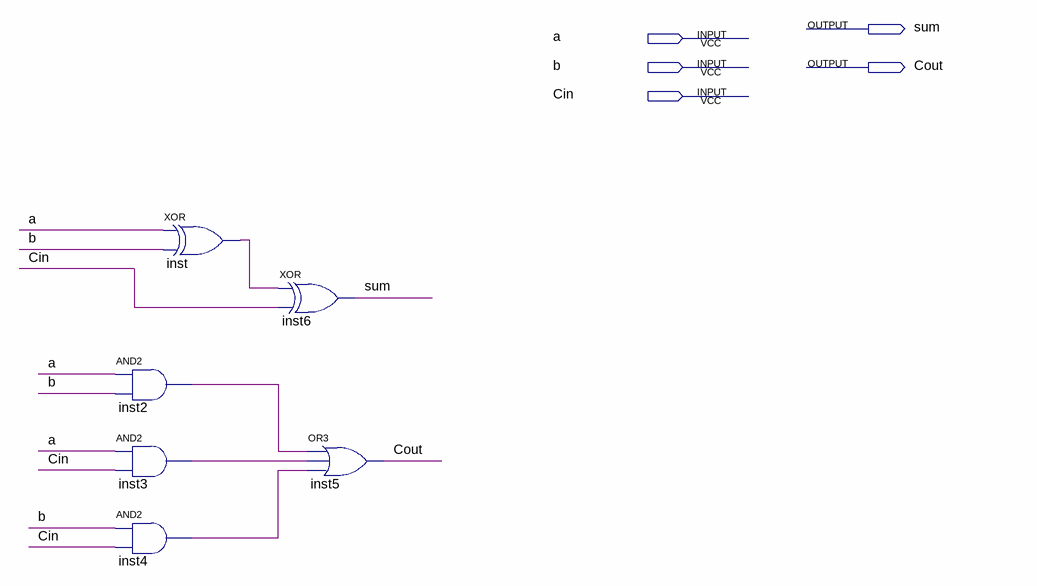
[diagram p0: schematic sheet]
// Quartus schematic 1BitAdder.bdf as structural Verilog: 6 symbols, 5 pins
module \1BitAdder  (
  input  a,
  input  b,
  input  Cin,
  output sum,
  output Cout
);

  wire inst2_out, inst3_out, inst4_out, inst_out;

  xor inst (inst_out, a, b);
  and inst2 (inst2_out, a, b);
  and inst3 (inst3_out, a, Cin);
  and inst4 (inst4_out, b, Cin);
  xor inst6 (sum, inst_out, Cin);
  or inst5 (Cout, inst2_out, inst3_out, inst4_out);
endmodule
